# EAGLE design emojipad_v2 (EAGLE 6.4)
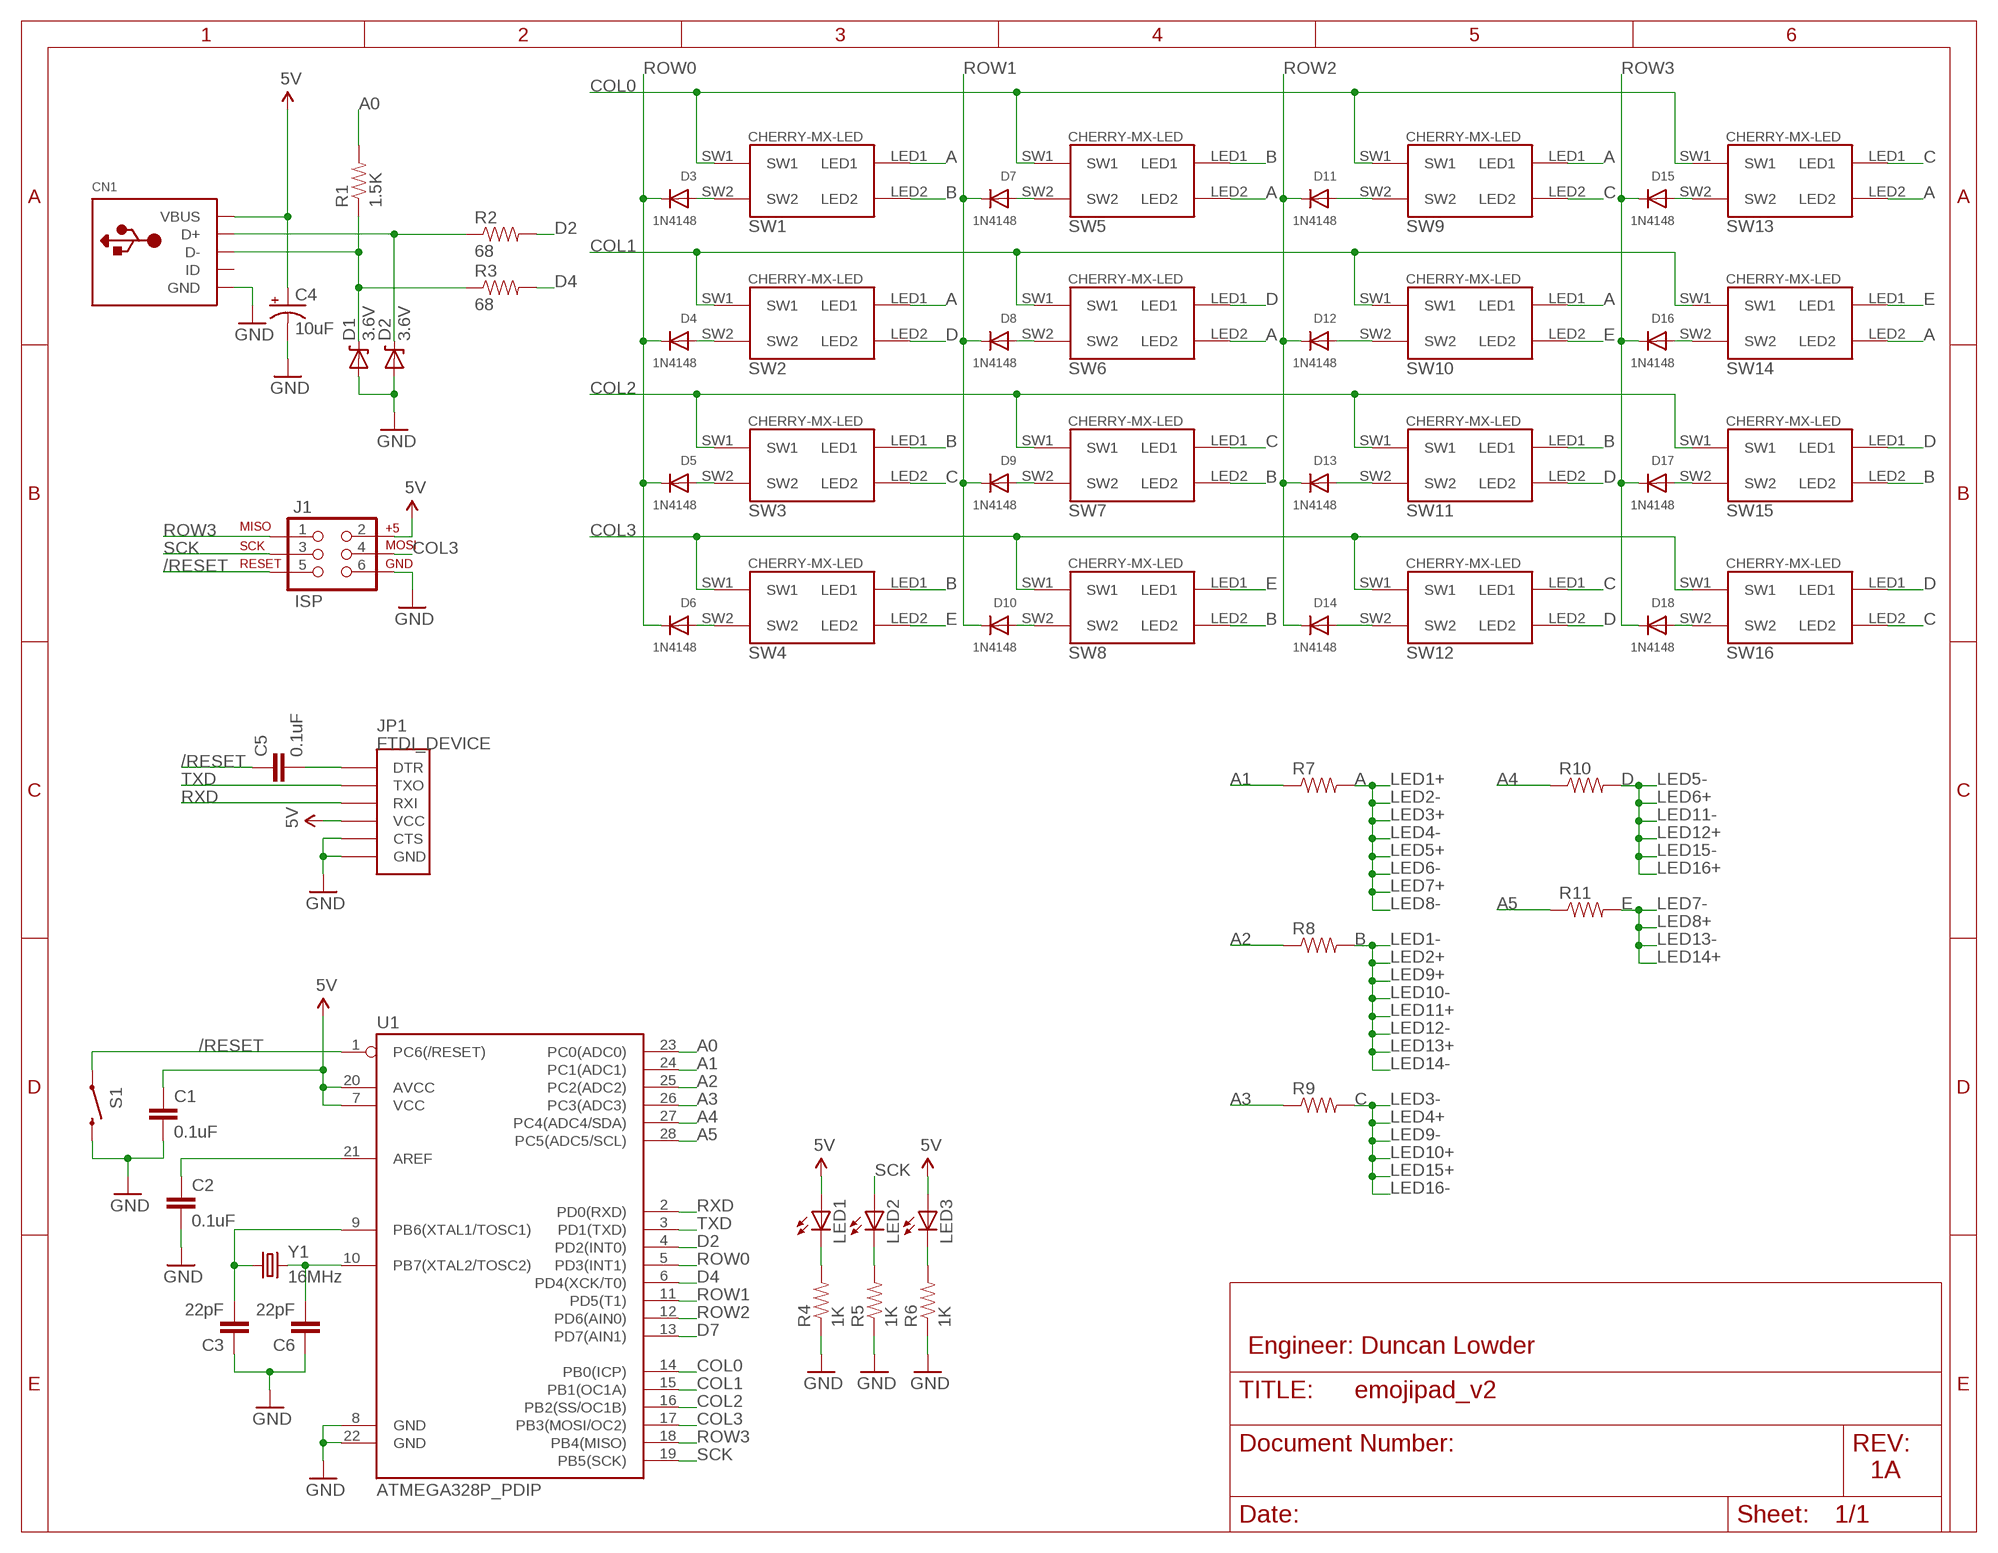
[diagram p0: schematic, sheet 1]

## Parts
C1  0.1uF  CAPPTH  [CAP-PTH-SMALL]
C2  0.1uF  CAPPTH  [CAP-PTH-SMALL]
C3  22pF  CAPPTH  [CAP-PTH-SMALL]
C4  10uF  CAP_POLPTH2  [CPOL-RADIAL-10UF-25V]
C5  0.1uF  CAPPTH  [CAP-PTH-SMALL]
C6  22pF  CAPPTH  [CAP-PTH-SMALL]
CN1  USBMOLEX  [USB-MINIB-THM-MOLEX]
D1  3.6V  DIODE-ZENERPTH  [DIODE-ZENER]
D2  3.6V  DIODE-ZENERPTH  [DIODE-ZENER]
D3  1N4148  DIODEDO-1N4148  [DO-1N4148]
D4  1N4148  DIODEDO-1N4148  [DO-1N4148]
D5  1N4148  DIODEDO-1N4148  [DO-1N4148]
D6  1N4148  DIODEDO-1N4148  [DO-1N4148]
D7  1N4148  DIODEDO-1N4148  [DO-1N4148]
D8  1N4148  DIODEDO-1N4148  [DO-1N4148]
D9  1N4148  DIODEDO-1N4148  [DO-1N4148]
D10  1N4148  DIODEDO-1N4148  [DO-1N4148]
D11  1N4148  DIODEDO-1N4148  [DO-1N4148]
D12  1N4148  DIODEDO-1N4148  [DO-1N4148]
D13  1N4148  DIODEDO-1N4148  [DO-1N4148]
D14  1N4148  DIODEDO-1N4148  [DO-1N4148]
D15  1N4148  DIODEDO-1N4148  [DO-1N4148]
D16  1N4148  DIODEDO-1N4148  [DO-1N4148]
D17  1N4148  DIODEDO-1N4148  [DO-1N4148]
D18  1N4148  DIODEDO-1N4148  [DO-1N4148]
J1  ISP  AVR_SPI_PRG_6PTH  [2X3]
JP1  FTDI_DEVICE  [FTDI_DEVICE_SIDE]
LED1  LED3MM  [LED3MM]
LED2  LED3MM  [LED3MM]
LED3  LED3MM  [LED3MM]
R1  1.5K  RESISTORAXIAL-0.3  [AXIAL-0.3]
R2  68  RESISTORAXIAL-0.3  [AXIAL-0.3]
R3  68  RESISTORAXIAL-0.3  [AXIAL-0.3]
R4  1K  RESISTORAXIAL-0.3  [AXIAL-0.3]
R5  1K  RESISTORAXIAL-0.3  [AXIAL-0.3]
R6  1K  RESISTORAXIAL-0.3  [AXIAL-0.3]
R7  RESISTORAXIAL-0.3  [AXIAL-0.3]
R8  RESISTORAXIAL-0.3  [AXIAL-0.3]
R9  RESISTORAXIAL-0.3  [AXIAL-0.3]
R10  RESISTORAXIAL-0.3  [AXIAL-0.3]
R11  RESISTORAXIAL-0.3  [AXIAL-0.3]
S1  SWITCH-MOMENTARY-2SIDE_EZ  [TACTILE-PTH-SIDEEZ]
SW1  CHERRY-MX-LED  [CHERRY-MX-LED]
SW2  CHERRY-MX-LED  [CHERRY-MX-LED]
SW3  CHERRY-MX-LED  [CHERRY-MX-LED]
SW4  CHERRY-MX-LED  [CHERRY-MX-LED]
SW5  CHERRY-MX-LED  [CHERRY-MX-LED]
SW6  CHERRY-MX-LED  [CHERRY-MX-LED]
SW7  CHERRY-MX-LED  [CHERRY-MX-LED]
SW8  CHERRY-MX-LED  [CHERRY-MX-LED]
SW9  CHERRY-MX-LED  [CHERRY-MX-LED]
SW10  CHERRY-MX-LED  [CHERRY-MX-LED]
SW11  CHERRY-MX-LED  [CHERRY-MX-LED]
SW12  CHERRY-MX-LED  [CHERRY-MX-LED]
SW13  CHERRY-MX-LED  [CHERRY-MX-LED]
SW14  CHERRY-MX-LED  [CHERRY-MX-LED]
SW15  CHERRY-MX-LED  [CHERRY-MX-LED]
SW16  CHERRY-MX-LED  [CHERRY-MX-LED]
U1  ATMEGA328P_PDIP  [DIL28-3]
Y1  16MHz  CRYSTALHC49US  [HC49US]

## Nets
5V: C1.1 C4.1(+) CN1.VBUS J1.2 JP1.P$4(VCC) LED1.A LED3.A U1.7(VCC) U1.20(AVCC)
/RESET: C5.1 J1.5 S1.1 U1.1(PC6(/RESET))
A: R7.P$2 SW1.LED1 SW2.LED1 SW5.LED2 SW6.LED2 SW9.LED1 SW10.LED1 SW13.LED2 SW14.LED2
A0: R1.P$2 U1.23(PC0(ADC0))
A1: R7.P$1 U1.24(PC1(ADC1))
A2: R8.P$1 U1.25(PC2(ADC2))
A3: R9.P$1 U1.26(PC3(ADC3))
A4: R10.P$1 U1.27(PC4(ADC4/SDA))
A5: R11.P$1 U1.28(PC5(ADC5/SCL))
B: R8.P$2 SW1.LED2 SW3.LED1 SW4.LED1 SW5.LED1 SW7.LED2 SW8.LED2 SW11.LED1 SW15.LED2
C: R9.P$2 SW3.LED2 SW7.LED1 SW9.LED2 SW12.LED1 SW13.LED1 SW16.LED2
COL0: SW1.SW1 SW5.SW1 SW9.SW1 SW13.SW1 U1.14(PB0(ICP))
COL1: SW2.SW1 SW6.SW1 SW10.SW1 SW14.SW1 U1.15(PB1(OC1A))
COL2: SW3.SW1 SW7.SW1 SW11.SW1 SW15.SW1 U1.16(PB2(SS/OC1B))
COL3: J1.4 SW4.SW1 SW8.SW1 SW12.SW1 SW16.SW1 U1.17(PB3(MOSI/OC2))
D: R10.P$2 SW2.LED2 SW6.LED1 SW11.LED2 SW12.LED2 SW15.LED1 SW16.LED1
D2: R2.P$2 U1.4(PD2(INT0))
D4: R3.P$2 U1.6(PD4(XCK/T0))
D7: U1.13(PD7(AIN1))
D+: CN1.D+ D2.P$1(C) R2.P$1
D-: CN1.D- D1.P$1(C) R1.P$1 R3.P$1
E: R11.P$2 SW4.LED2 SW8.LED1 SW10.LED2 SW14.LED1
GND: C1.2 C2.2 C3.1 C4.2(-) C6.1 CN1.GND D1.P$2(A) D2.P$2(A) J1.6 JP1.P$5(CTS) JP1.P$6(GND) R4.P$1 R5.P$1 R6.P$1 S1.2 U1.8(GND) U1.22(GND)
N$1: LED1.K(C) R4.P$2
N$2: D3.A SW1.SW2
N$3: D4.A SW2.SW2
N$4: D5.A SW3.SW2
N$5: C2.1 U1.21(AREF)
N$6: C6.2 U1.10(PB7(XTAL2/TOSC2)) Y1.2
N$7: D6.A SW4.SW2
N$8: D7.A SW5.SW2
N$9: D8.A SW6.SW2
N$10: D9.A SW7.SW2
N$11: D10.A SW8.SW2
N$12: D11.A SW9.SW2
N$13: D12.A SW10.SW2
N$14: D13.A SW11.SW2
N$15: D14.A SW12.SW2
N$16: D15.A SW13.SW2
N$17: D16.A SW14.SW2
N$18: D17.A SW15.SW2
N$19: D18.A SW16.SW2
N$20: C3.2 U1.9(PB6(XTAL1/TOSC1)) Y1.1
N$21: LED2.K(C) R5.P$2
N$23: LED3.K(C) R6.P$2
N$26: C5.2 JP1.P$1(DTR)
ROW0: D3.C D4.C D5.C D6.C U1.5(PD3(INT1))
ROW1: D7.C D8.C D9.C D10.C U1.11(PD5(T1))
ROW2: D11.C D12.C D13.C D14.C U1.12(PD6(AIN0))
ROW3: D15.C D16.C D17.C D18.C J1.1 U1.18(PB4(MISO))
RXD: JP1.P$3(RXI) U1.2(PD0(RXD))
SCK: J1.3 LED2.A U1.19(PB5(SCK))
TXD: JP1.P$2(TXO) U1.3(PD1(TXD))
Unconnected: CN1.ID

## Notes on the sheet
- LED1+ | LED5-
- LED2- | LED6+
- LED3+ | LED11-
- LED4- | LED12+
- LED5+ | LED15-
- LED6- | LED16+
- LED7+
- LED8- | LED7-
- LED8+
- LED1- | LED13-
- LED2+ | LED14+
- LED9+
- LED10-
- LED11+
- LED12-
- LED13+
- LED14-
- LED3-
- LED4+
- LED9-
- LED10+
- LED15+
- LED16-
- Engineer: Duncan Lowder
- 1A

## Library data of the parts
C1-C3 C6 = SparkFun-Capacitors:CAP: Capacitor Standard 0603 ceramic capacitor, and 0.1" leaded capacitor.
C4 = SparkFun-Capacitors:CAP_POL: Capacitor Polarized These are standard SMD and PTH capacitors. Normally 10uF, 47uF, and 100uF in electrolytic and tantalum varieties. Always verify the external diameter of the through hole cap, it varies with capacity, voltage, and manufacturer. The EIA devices should be standard.
C5 = SparkFun-Passives:CAP: Capacitor Standard 0603 ceramic capacitor, and 0.1" leaded capacitor.
CN1 = adafruit_1:USB: USB Connectors USBMINIB - Surface Mount Female Mini-B USB Connector 4UConnector: 06564 By microbuilder.eu Thru-hole RA Female Mini-B USB Connector 4UConnector: 18732 By ladyada.net
D1 D2 = SparkFun-DiscreteSemi:DIODE-ZENER: Zener Diode Production Part - 8199 3.4V Zener Voltage
D3-D18 = adafruit:DIODE: Diode SMADIODE - SMA Surface Mount Package 20V 1A Schottky Diode Digikey: 641-1014-6-ND DO-1N4148 - Through Hole Small Current Diode SOD-123 20V 1 A (.5mV Vf) Schottky Diode - Digikey: MBRX120TPMSCT-ND SOD-323 10V 570mA (.38mV Vf, 3ns) Schottky Diode - Digikey: ZLLS410CT-ND SOD-523 30V 30mA Schottky Diode (RB751S-40TE61) - Digikey: RB751S-40TE61CT-ND SOT23-R/W - SOT23 Package (R = Solder Paste/Reflow Ovens, W = Hand-Soldering) BAT54Film 40V 300mA - Digikey: 497-7162-1-ND
J1 = SparkFun-Connectors:AVR_SPI_PRG_6: AVR ISP 6 Pin This is the reduced ISP connector for AVR programming. Common on Arduino. This footprint will take up less PCB space and can be used with a 10-pin to 6-pin adapter such as SKU: BOB-08508
JP1 = SparkFun-Connectors:FTDI_DEVICE: Connector which mates to FTDI basic or FTDI cable.
LED1-LED3 = SparkFun-LED:LED: LEDs Standard schematic elements and footprints for 5mm, 3mm, 1206, and 0603 sized LEDs. 5mm - Spark Fun Electronics SKU : COM-00529 (and others)
R1 R4-R11 = SparkFun-Passives:RESISTOR: Resistor Basic schematic elements and footprints for 0603, 1206, and PTH resistors.
R2 R3 = SparkFun-Resistors:RESISTOR: Resistor Basic schematic elements and footprints for 0603, 1206, and PTH resistors.
S1 = SparkFun-Electromechanical:SWITCH-MOMENTARY-2: Various NO switches- pushbuttons, reed, etc
SW1-SW16 = cherrymx:CHERRY-MX-LED: Cherry MX series keyswitch with LED
U1 = SparkFun-DigitalIC:ATMEGA328P_PDIP: uC used in the Arduino 32kb flash, 1k EEPROM, 2k SRAM This is the through-hole version of this chip.
Y1 = SparkFun-FreqCtrl:CRYSTAL: Various standard crystals. Proven footprints. Spark Fun Electronics SKU : COM-00534

## Board
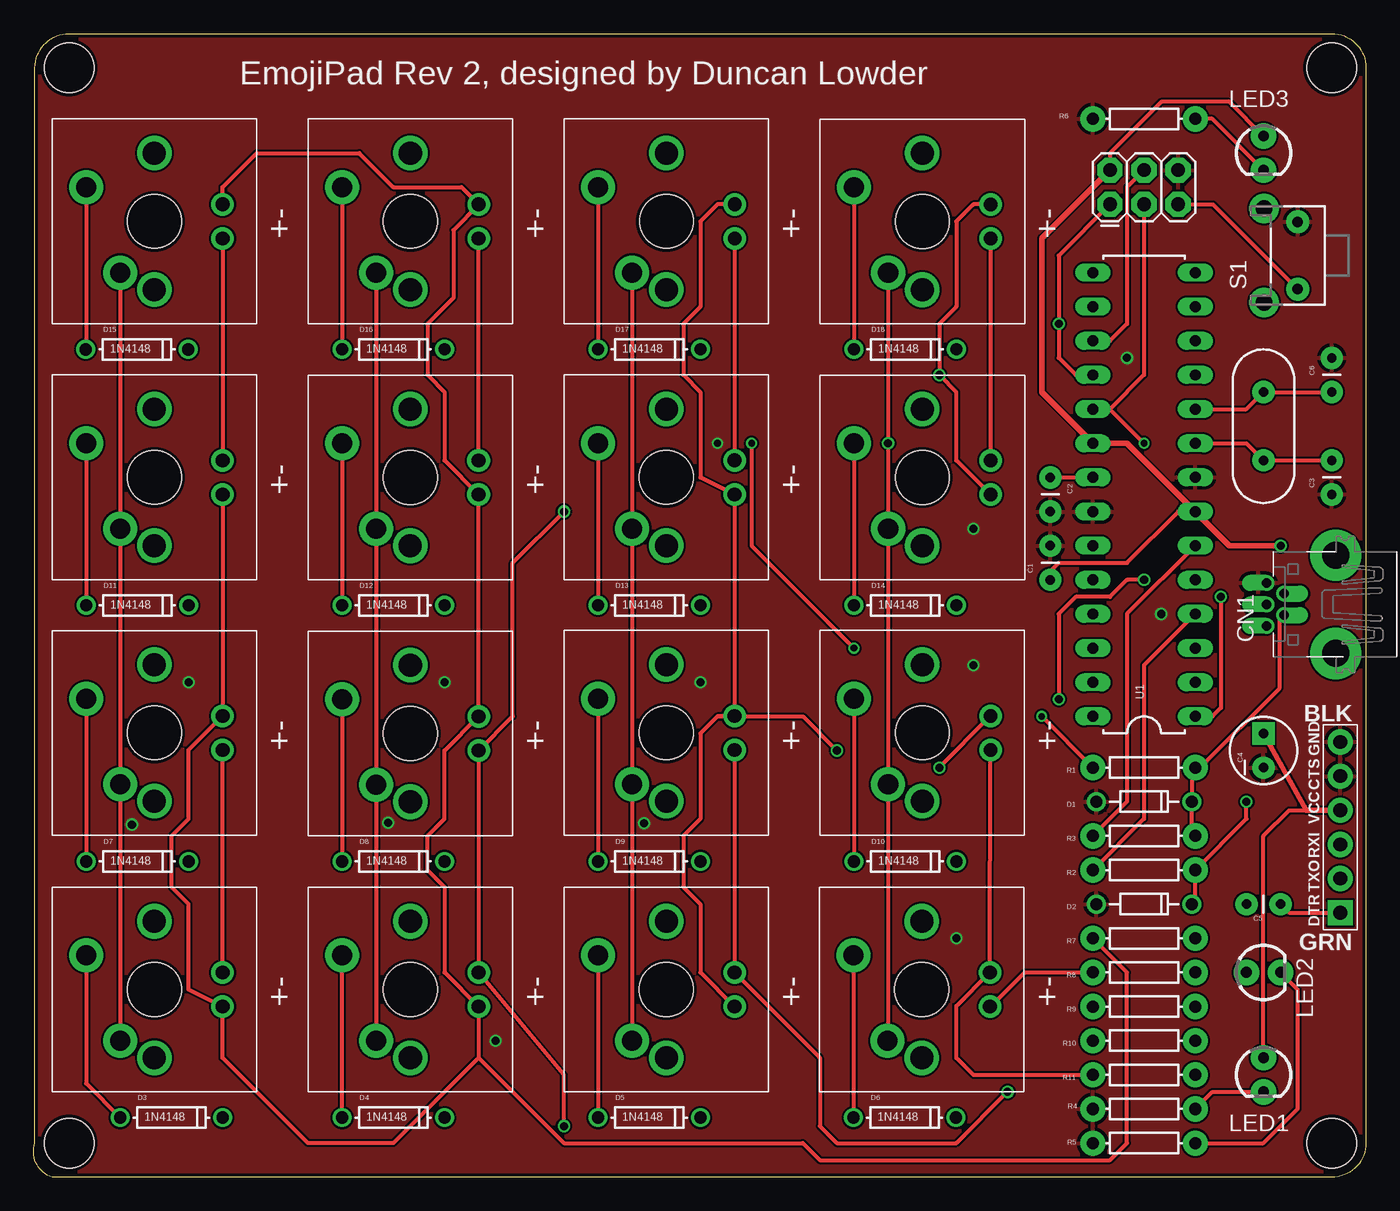
[diagram p1: board, top side]
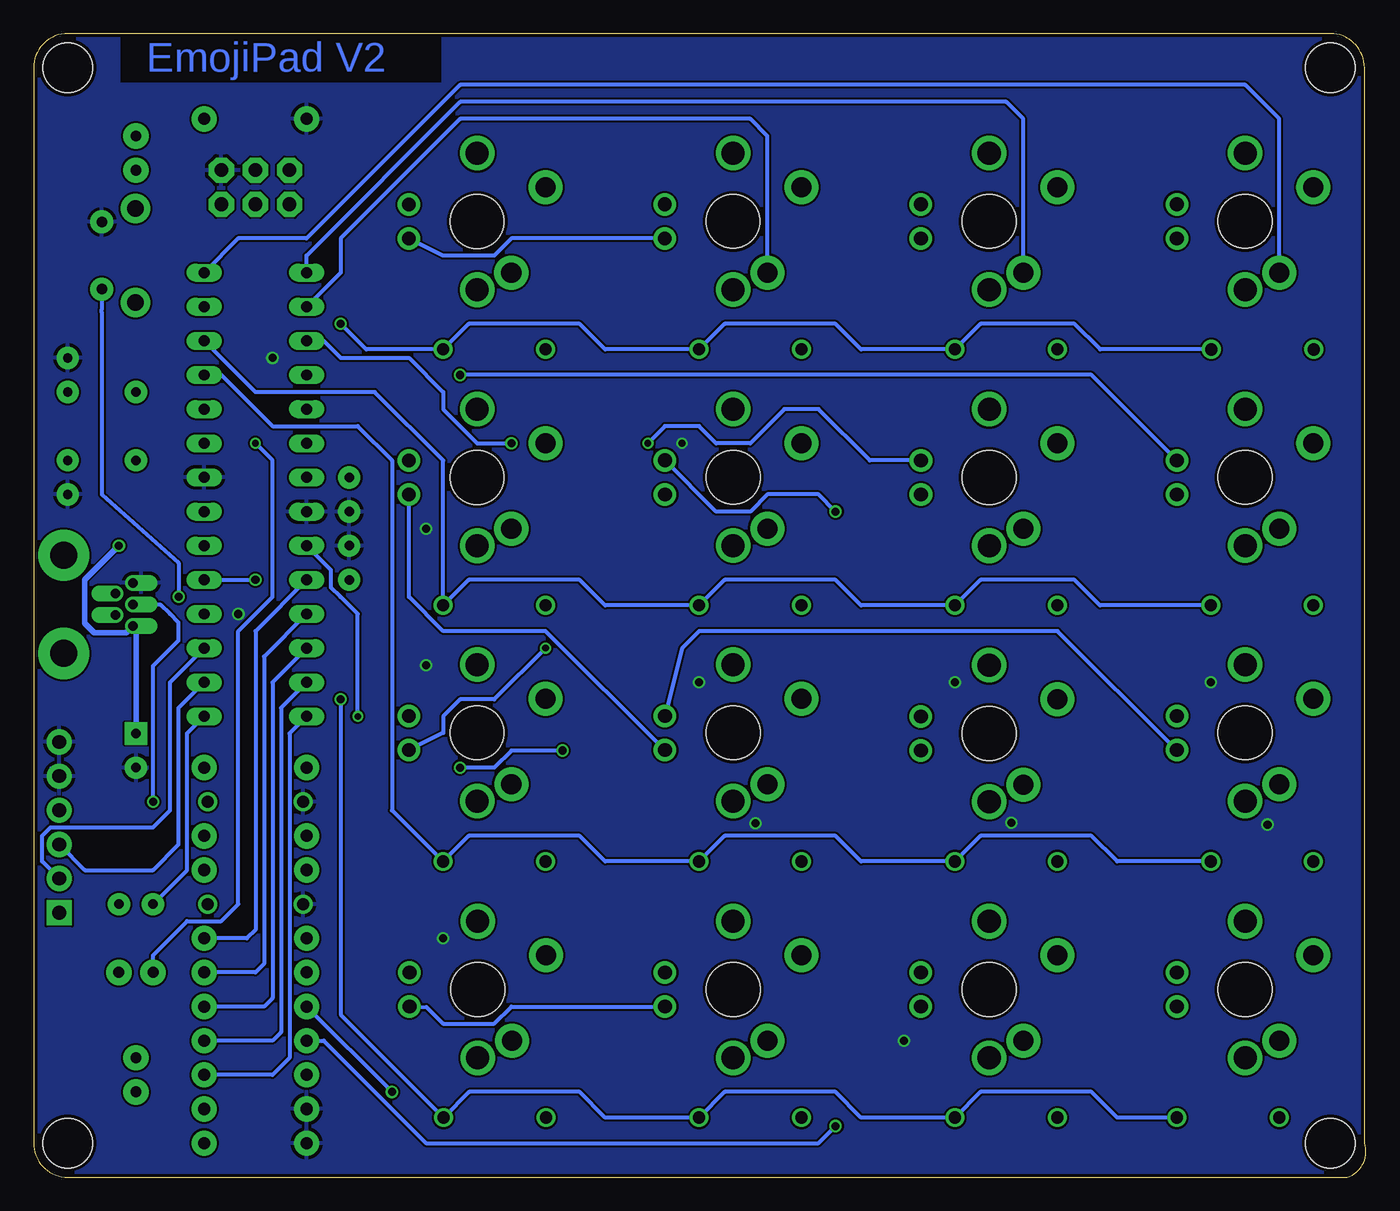
[diagram p2: board, bottom side, seen from below]

Size 99.16 x 85.09 mm. Coordinates in mm from the lower left corner, seen from the top.
Outline: 2.64,85.09 96.62,85.09 arc-90 99.16,82.55 99.16,2.54 arc-90 96.62,0 1.37,0 arc-90 0.1,2.54 0.1,82.55 arc-90 2.64,85.09
Copper layers (1*16): Top 0.035mm / dielectric 1.5mm / Bottom 0.035mm
Design rules "SeeedStudio_2layer_DRU_no_angle_20140221": minimum track width 6mil, minimum drill 12mil, track to track 6mil, track to pad 6mil, pad to pad 6mil, via to via 6mil, smd to smd 0mil, copper to edge 10mil, drill to drill 10mil, minimum pad ring 10mil, minimum via ring 6mil, stop-mask expansion 2mil, vias tented up to drill 100mil, thermal gap 10mil
Holes 3.7 mm at 96.62,2.54 2.64,2.54 2.64,82.55 96.62,82.55

### Footprints (pad centres in the part's own frame; a part is rotated, then mirrored left to right if it is on the bottom)
CAP-PTH-SMALL = drill 0.7 pad 1.651: 1 0,0; 2 2.54,0
CPOL-RADIAL-10UF-25V = drill 0.7 pad 1.651 square: 1 1.27,0 | drill 0.7 pad 1.651: 2 -1.27,0
USB-MINIB-THM-MOLEX = drill 0.7 offset: D+ 0,9.72; D- -0.8,8.42; GND 1.6,9.72; ID 0.8,8.42; VBUS -1.6,9.72 | drill 2 pad 3.81: GND1 -3.65,4.57; GND4 3.65,4.57
DIODE-ZENER = drill 0.9: P$1 -3.556,0; P$2 3.556,0
DO-1N4148 = drill 0.9: A -3.81,0; C 3.81,0
2X3 = drill 1.016 pad 1.88 octagon: 1 0,0; 2 0,2.54; 3 2.54,0; 4 2.54,2.54; 5 5.08,0; 6 5.08,2.54
FTDI_DEVICE_SIDE = drill 1.016 pad 1.88 square: P$1 -6.35,0 | drill 1.016 pad 1.88: P$2 -3.81,0; P$3 -1.27,0; P$4 1.27,0; P$5 3.81,0; P$6 6.35,0
LED3MM = drill 0.813 pad 1.88: A -1.27,0; K 1.27,0
AXIAL-0.3 = drill 0.9 pad 1.88: P$1 -3.81,0; P$2 3.81,0
TACTILE-PTH-SIDEEZ = drill 0.8 pad 1.7: 1 -2.5,0; 2 2.5,0 | drill 1.2 pad 2.2: ANCHOR1 -3.5,2.5; ANCHOR2 3.5,2.5
CHERRY-MX-LED = drill 1.016 pad 1.676: LED1 -1.27,-5.08; LED2 1.27,-5.08 | drill 1.714 pad 1.93: P$3 -5.08,0; P$4 5.08,0 | drill 1.5 pad 2.54: SW1 -3.81,2.54; SW2 2.54,5.08 | hole 4: 0,0
DIL28-3 = drill 0.813 long: 1 -16.51,-3.81; 2 -13.97,-3.81; 3 -11.43,-3.81; 4 -8.89,-3.81; 5 -6.35,-3.81; 6 -3.81,-3.81; 7 -1.27,-3.81; 8 1.27,-3.81; 9 3.81,-3.81; 10 6.35,-3.81; 11 8.89,-3.81; 12 11.43,-3.81; 13 13.97,-3.81; 14 16.51,-3.81; 15 16.51,3.81; 16 13.97,3.81; 17 11.43,3.81; 18 8.89,3.81; 19 6.35,3.81; 20 3.81,3.81; 21 1.27,3.81; 22 -1.27,3.81; 23 -3.81,3.81; 24 -6.35,3.81; 25 -8.89,3.81; 26 -11.43,3.81; 27 -13.97,3.81; 28 -16.51,3.81
HC49US = drill 0.7 pad 1.651: 1 -2.54,0; 2 2.54,0

### Placement (x,y rotation side)
C1  75.67,44.45 90 top
C2  75.67,52.07 270 top
C3  96.62,50.8 90 top
C4  91.54,31.75 90 top
C5  90.27,20.32 0 top
C6  96.62,60.96 270 top
CN1  101.48,42.63 90 top
D1  82.65,27.94 180 top
D2  82.65,20.32 180 top
D3  10.26,4.45 0 top
D4  26.77,4.45 0 top
D5  45.82,4.45 0 top
D6  64.83,4.45 0 top
D7  7.72,23.5 0 top
D8  26.77,23.5 0 top
D9  45.82,23.5 0 top
D10  64.87,23.5 0 top
D11  7.72,42.55 0 top
D12  26.77,42.55 0 top
D13  45.82,42.55 0 top
D14  64.87,42.55 0 top
D15  7.7,61.59 0 top
D16  26.77,61.59 0 top
D17  45.82,61.59 0 top
D18  64.87,61.59 0 top
J1  80.11,72.39 0 top
JP1  97.26,26.04 90 top
LED1  91.54,7.62 270 top
LED2  91.54,15.24 0 top
LED3  91.54,76.2 270 top
R1  82.65,30.48 180 top
R2  82.65,22.86 180 top
R3  82.65,25.4 180 top
R4  82.65,5.08 0 top
R5  82.65,2.54 0 top
R6  82.65,78.74 0 top
R7  82.65,17.78 180 top
R8  82.65,15.24 180 top
R9  82.65,12.7 180 top
R10  82.65,10.16 180 top
R11  82.65,7.62 180 top
S1  94.08,68.58 90 top
SW1  8.99,13.97 90 top
SW2  28.04,13.97 90 top
SW3  47.09,13.97 90 top
SW4  66.1,13.97 90 top
SW5  8.99,33.06 90 top
SW6  28.04,33.02 90 top
SW7  47.09,33.06 90 top
SW8  66.14,33.06 90 top
SW9  8.99,52.07 90 top
SW10  28.04,52.07 90 top
SW11  47.09,52.07 90 top
SW12  66.14,52.07 90 top
SW13  8.99,71.12 90 top
SW14  28.04,71.12 90 top
SW15  47.09,71.12 90 top
SW16  66.14,71.11 90 top
U1  82.65,50.8 90 top
Y1  91.54,55.88 90 top

### Tracks (layer width: path | path; a pad name or v marks a point on that pad's centre or on a via)
5V  (via drill 0.6)
  Top 0.305: U1.7 85.19,49.53 81.38,45.72 76.3,45.72 75.67,45.09 C1.1 | 96.62,27.3 93.45,27.3 91.54,25.4 LED1.A | LED3.A 89,80.01 83.92,80.01 80.11,76.2 J1.2
  Top 0.406: J1.2 75.03,69.85 75.03,58.42 U1.20 81.38,54.61 U1.7 89,46.99 v92.81,46.99 | C4.1 94.72,27.3 96.62,27.3 JP1.P$4
  Bottom 0.406: v92.81,46.99 95.35,44.45 95.35,41.23 94.63,40.51 92.28,40.51 CN1.VBUS 91.54,40.8 C4.1
/RESET  (via drill 0.6)
  Top 0.305: v88.37,43.18 88.37,34.92 87.73,34.29 U1.1 | J1.5 87.77,72.39 S1.1
  Bottom 0.305: C5.1 87.73,22.86 87.73,33.02 U1.1 | v88.37,43.18 88.37,45.72 94.08,50.8 94.08,64.34 94.09,64.53 94.08,64.77 S1.1
A
  Top 0.305: SW9.LED1 SW5.LED2 11.53,31.79 11.53,26.67 10.26,25.4 10.26,21.59 11.53,20.32 11.53,13.97 SW1.LED1 14.07,8.89 20.42,2.54 26.77,2.54 33.12,8.89 | R7.P$2 81.38,15.24 81.38,2.54 80.11,1.27 58.52,1.27 57.25,2.54 39.47,2.54 33.12,8.89 | SW13.LED2 14.07,73.66 16.61,76.2 24.23,76.2 26.77,73.66 31.85,73.66 SW14.LED2 33.12,72.34 31.24,70.47 31.24,65.43 29.31,63.5 29.31,59.69 30.58,58.42 30.58,53.33 SW10.LED1 SW6.LED2 30.58,31.75 30.58,26.67 29.31,25.4 29.31,22.86 30.58,21.59 30.58,15.24 SW2.LED1 33.12,8.89
A0  (via drill 0.5)
  Top 0.305: R1.P$2 v75.03,34.29
  Bottom 0.305: v75.03,34.29 75.03,41.91 76.3,43.18 76.32,43.18 77.02,43.88 77.02,45.17 U1.23
A1
  Bottom 0.305: U1.24 82.65,40.64 82.65,18.41 83.29,17.78 R7.P$1
A2
  Bottom 0.305: U1.25 82.02,38.73 82.02,15.88 82.65,15.24 R8.P$1
A3
  Bottom 0.305: U1.26 81.38,36.83 81.38,13.34 82.02,12.7 R9.P$1
A4
  Bottom 0.305: U1.27 80.75,34.92 80.75,10.79 81.38,10.16 R10.P$1
A5
  Bottom 0.305: U1.28 80.11,33.02 80.11,8.89 81.38,7.62 R11.P$1
B  (via drill 0.6)
  Top 0.305: SW15.LED2 50.9,72.39 49.63,71.12 49.63,64.77 48.36,63.5 48.36,59.69 49.63,58.42 49.63,52.07 SW11.LED1 SW7.LED2 50.9,34.29 | 50.9,34.29 49.63,33.02 49.63,26.67 48.36,25.4 48.36,21.59 49.63,20.32 49.63,15.24 SW3.LED1 | 50.9,34.29 57.25,34.29 v59.79,31.75 | SW4.LED1 71.22,12.7 73.76,15.24 R8.P$2 | v67.41,30.48 67.41,30.52 SW8.LED2 | SW1.LED2 SW5.LED1
  Bottom 0.305: SW5.LED1 14.11,31.79 22.96,40.64 49.63,40.64 50.9,39.37 SW7.LED2 | v59.79,31.75 63.6,31.75 64.87,30.48 v67.41,30.48 | SW4.LED1 69.91,12.66 68.68,11.43 64.87,11.43 63.6,12.7 SW3.LED1
C  (via drill 0.6)
  Top 0.305: SW13.LED1 SW9.LED2 | SW7.LED1 SW3.LED2 58.52,8.89 58.52,3.81 59.79,2.54 68.68,2.54 v72.49,6.35 | SW16.LED2 69.95,72.39 68.68,71.12 68.68,64.77 67.41,63.5 v67.41,59.69 68.68,58.42 68.68,53.34 SW12.LED1
  Bottom 0.305: SW9.LED2 | SW9.LED2 20.42,59.69 v67.41,59.69 | v72.49,6.35 R9.P$2 | SW12.LED1 71.22,43.18 68.68,40.64 61.06,40.64 52.21,31.79 SW7.LED1
COL0
  Top 0.305: SW13.SW1 SW9.SW1 SW5.SW1 SW1.SW1
  Bottom 0.305: SW13.SW1 6.45,78.74 8.99,81.28 67.41,81.28 78.84,69.85 83.92,69.85 U1.14
COL1
  Top 0.305: SW10.SW1 SW6.SW1 SW2.SW1 | SW14.SW1 SW10.SW1 | SW10.SW1
  Bottom 0.305: SW14.SW1 25.5,78.74 26.77,80.01 67.41,80.01 78.84,68.58 U1.15
COL2
  Top 0.305: SW15.SW1 SW11.SW1 SW7.SW1 44.55,29.21 SW3.SW1
  Bottom 0.305: SW15.SW1 44.55,77.47 45.82,78.74 67.41,78.74 76.3,69.85 76.3,67.31 U1.16
COL3  (via drill 0.6)
  Top 0.305: J1.4 81.38,73.66 81.38,63.5 80.11,62.23 U1.17 | SW16.SW1 v63.6,54.61 SW12.SW1 SW8.SW1 63.6,10.16 SW4.SW1
  Bottom 0.305: U1.17 77.57,62.23 76.3,60.96 71.22,60.96 68.68,58.42 68.68,57.15 66.14,54.61 v63.6,54.61
D  (via drill 0.6)
  Top 0.305: SW15.LED1 SW11.LED2 | SW16.LED1 SW12.LED2 | v39.47,49.53 35.66,45.72 35.66,34.29 SW6.LED1 SW2.LED2 39.47,7.62 v39.47,3.81
  Bottom 0.305: SW15.LED1 63.6,69.85 64.87,68.58 68.69,68.58 SW16.LED1 | v39.47,49.53 40.74,50.8 44.55,50.8 45.82,49.53 48.36,49.53 SW11.LED2 | R10.P$2 77.57,10.16 69.95,2.54 40.74,2.54 v39.47,3.81
D2
  Top 0.305: U1.4 82.65,38.1 82.65,26.67 R2.P$2
D4
  Top 0.305: U1.6 81.38,41.91 81.38,27.94 R3.P$2
D+  (via drill 0.6)
  Top 0.305: D2.P$1 86.46,20.57 R2.P$1 90.27,26.67 v90.27,27.94
  Bottom 0.305: v90.27,27.94 90.27,38.05 88.37,39.95 88.37,41.27 89,41.91 89.01,41.91 89.69,42.59 91.73,42.59 CN1.D+
D-
  Top 0.305: R3.P$1 86.21,25.65 D1.P$1 86.21,30.23 R1.P$1 86.82,30.48 92.74,36.4 92.74,41.5 CN1.D-
E  (via drill 0.5)
  Top 0.305: SW8.LED1 SW4.LED2 68.68,12.74 68.68,8.89 69.95,7.62 R11.P$2 | v53.44,54.61 53.44,46.99 v61.06,39.37 | SW10.LED2 SW14.LED1
  Bottom 0.305: SW10.LED2 36.93,53.34 40.74,57.15 43.28,57.15 45.82,54.61 48.36,54.61 49.63,55.88 52.17,55.88 v53.44,54.61 | v61.06,39.37 64.87,35.56 67.41,35.56 68.68,34.29 68.68,33.06 SW8.LED1
GND  (via drill 0.5, 0.6)
  Bottom 0.152: 97.31,30.48 97.89,30.48 JP1.P$5
  other vias: 68.68,17.78 81.38,60.96 83.92,41.91 11.53,36.83 30.58,36.83 49.63,36.83 45.44,26.33 26.38,26.37 7.32,26.24 34.39,10.16 69.95,48.26 69.95,38.1 50.9,54.61
  pour Top: 0.1,0 0.1,85.09 99.16,85.09 99.16,0
  pour Bottom: 0.1,0 0.1,85.09 68.68,85.09 68.68,81.28 92.81,81.28 92.81,85.09 99.16,85.09 99.16,0
N$1
  Top 0.305: R4.P$2 87.73,6.35 LED1.K
N$2
  Top 0.305: SW1.SW2 3.91,6.99 D3.A
N$3
  Top 0.305: D4.A SW2.SW2
N$4
  Top 0.305: SW3.SW2 D5.A
N$5
  Top 0.305: C2.1 U1.21
N$6
  Top 0.305: U1.10 90.27,57.15 Y1.2 C6.2
N$7
  Top 0.305: SW4.SW2 D6.A
N$8
  Top 0.305: SW5.SW2 D7.A
N$9
  Top 0.305: SW6.SW2 D8.A
N$10
  Top 0.305: SW7.SW2 D9.A
N$11
  Top 0.305: SW8.SW2 D10.A
N$12
  Top 0.305: SW9.SW2 D11.A
N$13
  Top 0.305: SW10.SW2 D12.A
N$14
  Top 0.305: SW11.SW2 D13.A
N$15
  Top 0.305: SW12.SW2 D14.A
N$16
  Top 0.305: SW13.SW2 3.91,61.61 D15.A
N$17
  Top 0.305: SW14.SW2 D16.A
N$18
  Top 0.305: SW15.SW2 D17.A
N$19
  Top 0.305: SW16.SW2 D18.A
N$20
  Top 0.305: U1.9 90.27,54.61 Y1.1 C3.2
N$21
  Top 0.305: R5.P$2 91.54,2.54 94.08,5.08 94.08,13.97 LED2.K
N$23
  Top 0.305: LED3.K 87.73,78.74 R6.P$2
N$26
  Top 0.305: C5.2 93.45,19.68 JP1.P$1
ROW0  (via drill 0.6)
  Top 0.305: v82.65,44.45 81.38,44.45 80.11,43.18 77.57,43.18 76.3,41.91 v76.3,35.56
  Bottom 0.305: D3.C 18.52,4.45 20.42,6.35 28.68,6.35 D4.C 37.57,4.45 39.47,6.35 47.73,6.35 D5.C 56.62,4.45 58.52,6.35 66.73,6.35 D6.C 76.3,12.11 v76.3,35.56 | U1.5 v82.65,44.45
ROW1
  Bottom 0.305: D7.C 18.52,23.5 20.42,25.4 28.68,25.4 D8.C 37.57,23.5 39.47,25.4 47.73,25.4 D9.C 56.62,23.5 58.52,25.4 66.78,25.4 D10.C 72.49,27.3 72.49,53.34 75.03,55.88 81.38,55.88 85.19,59.69 U1.11
ROW2
  Bottom 0.305: D11.C 19.79,42.55 21.69,44.45 28.68,44.45 D12.C 37.57,42.55 39.47,44.45 47.73,44.45 D13.C 56.62,42.55 58.52,44.45 66.78,44.45 D14.C 68.68,53.34 73.76,58.42 82.65,58.42 U1.12
ROW3  (via drill 0.6)
  Top 0.305: J1.1 76.3,68.58 v76.3,63.5 76.3,60.96 77.57,59.69 U1.18
  Bottom 0.305: D15.C 19.78,61.59 21.69,63.5 28.68,63.5 D16.C 37.57,61.59 39.47,63.5 47.73,63.5 D17.C 56.62,61.59 58.52,63.5 66.78,63.5 D18.C 74.4,61.59 v76.3,63.5
RXD
  Bottom 0.305: JP1.P$3 95.35,22.86 90.27,22.86 88.37,24.77 88.37,34.92 U1.2
SCK  (via drill 0.5)
  Top 0.305: J1.3 82.65,59.69 80.11,57.15 | 80.11,57.15 U1.19 | v82.65,54.61 80.11,57.15
  Bottom 0.305: LED2.A 90.27,16.51 87.73,19.05 85.19,19.05 83.92,20.32 83.92,40.64 81.38,43.18 81.38,53.34 v82.65,54.61
TXD
  Bottom 0.305: JP1.P$2 98.53,23.5 98.53,25.4 97.89,26.04 90.27,26.04 89,27.3 89,36.83 U1.3

### Text on the board
Bottom: EmojiPad V2
tNames: EmojiPad Rev 2, designed by Duncan Lowder | +- | +- | +- | +- | +- | +- | +- | +- | +- | +- | +- | +- | +- | +- | +-
tValues: 1K | 22pF | 0.1uF | 22pF | 0.1uF | 0.1uF | 1.5K | 3.6V | 68 | 68 | 0.1uF | 3.6V | 100 | 100 | 100 | 100 | 100 | 1K | 1K